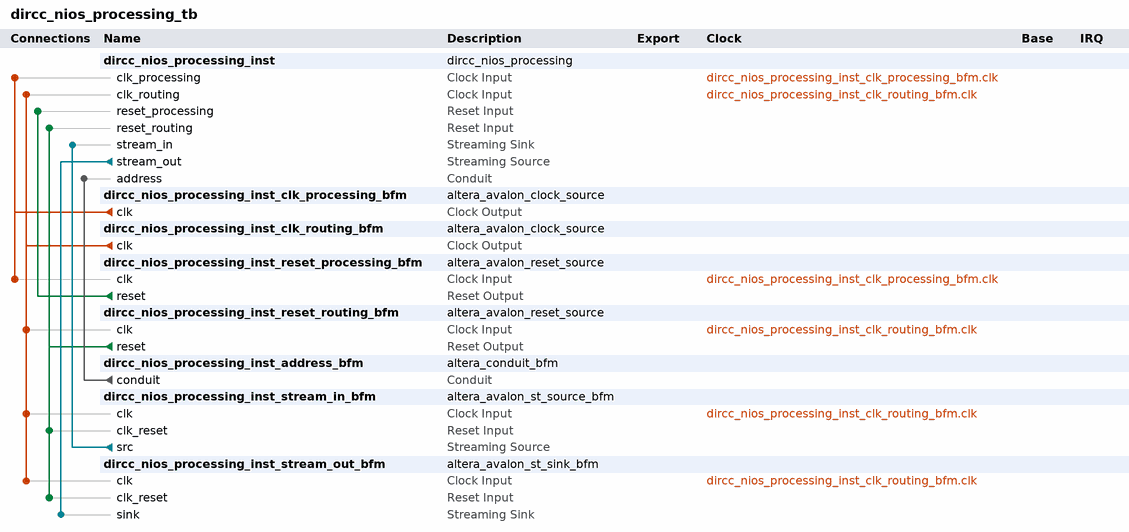
[diagram p0: system contents]
# Platform Designer (Qsys) system dircc_nios_processing_tb, Cyclone V 5CSEMA5F31C6
# Parameters at their usual value, and those the tool derives, are not listed.
package require -exact qsys 16.1
create_system dircc_nios_processing_tb
set_project_property DEVICE_FAMILY {Cyclone V}
set_project_property DEVICE 5CSEMA5F31C6

add_instance dircc_nios_processing_inst dircc_nios_processing 1.0

add_instance dircc_nios_processing_inst_clk_processing_bfm altera_avalon_clock_source 16.1

add_instance dircc_nios_processing_inst_clk_routing_bfm altera_avalon_clock_source 16.1

add_instance dircc_nios_processing_inst_reset_processing_bfm altera_avalon_reset_source 16.1
set_instance_parameter_value dircc_nios_processing_inst_reset_processing_bfm ASSERT_HIGH_RESET 0
set_instance_parameter_value dircc_nios_processing_inst_reset_processing_bfm INITIAL_RESET_CYCLES 50

add_instance dircc_nios_processing_inst_reset_routing_bfm altera_avalon_reset_source 16.1
set_instance_parameter_value dircc_nios_processing_inst_reset_routing_bfm ASSERT_HIGH_RESET 0
set_instance_parameter_value dircc_nios_processing_inst_reset_routing_bfm INITIAL_RESET_CYCLES 50

add_instance dircc_nios_processing_inst_address_bfm altera_conduit_bfm 16.1
set_instance_parameter_value dircc_nios_processing_inst_address_bfm CLOCKED_SIGNAL false
set_instance_parameter_value dircc_nios_processing_inst_address_bfm ENABLE_RESET false
set_instance_parameter_value dircc_nios_processing_inst_address_bfm SIGNAL_DIRECTIONS output
set_instance_parameter_value dircc_nios_processing_inst_address_bfm SIGNAL_ROLES address
set_instance_parameter_value dircc_nios_processing_inst_address_bfm SIGNAL_WIDTHS 32

add_instance dircc_nios_processing_inst_stream_in_bfm altera_avalon_st_source_bfm 16.1
set_instance_parameter_value dircc_nios_processing_inst_stream_in_bfm ST_CHANNEL_W 1
set_instance_parameter_value dircc_nios_processing_inst_stream_in_bfm ST_ERROR_W 1
set_instance_parameter_value dircc_nios_processing_inst_stream_in_bfm ST_MAX_CHANNELS 0
set_instance_parameter_value dircc_nios_processing_inst_stream_in_bfm ST_NUMSYMBOLS 4
set_instance_parameter_value dircc_nios_processing_inst_stream_in_bfm ST_READY_LATENCY 1
set_instance_parameter_value dircc_nios_processing_inst_stream_in_bfm ST_SYMBOL_W 8
set_instance_parameter_value dircc_nios_processing_inst_stream_in_bfm USE_CHANNEL 0
set_instance_parameter_value dircc_nios_processing_inst_stream_in_bfm USE_EMPTY 1
set_instance_parameter_value dircc_nios_processing_inst_stream_in_bfm USE_ERROR 0
set_instance_parameter_value dircc_nios_processing_inst_stream_in_bfm USE_PACKET 1
set_instance_parameter_value dircc_nios_processing_inst_stream_in_bfm USE_READY 1
set_instance_parameter_value dircc_nios_processing_inst_stream_in_bfm USE_VALID 1

add_instance dircc_nios_processing_inst_stream_out_bfm altera_avalon_st_sink_bfm 16.1
set_instance_parameter_value dircc_nios_processing_inst_stream_out_bfm ST_CHANNEL_W 1
set_instance_parameter_value dircc_nios_processing_inst_stream_out_bfm ST_ERROR_W 1
set_instance_parameter_value dircc_nios_processing_inst_stream_out_bfm ST_MAX_CHANNELS 0
set_instance_parameter_value dircc_nios_processing_inst_stream_out_bfm ST_NUMSYMBOLS 4
set_instance_parameter_value dircc_nios_processing_inst_stream_out_bfm ST_READY_LATENCY 1
set_instance_parameter_value dircc_nios_processing_inst_stream_out_bfm ST_SYMBOL_W 8
set_instance_parameter_value dircc_nios_processing_inst_stream_out_bfm USE_CHANNEL 0
set_instance_parameter_value dircc_nios_processing_inst_stream_out_bfm USE_EMPTY 1
set_instance_parameter_value dircc_nios_processing_inst_stream_out_bfm USE_ERROR 0
set_instance_parameter_value dircc_nios_processing_inst_stream_out_bfm USE_PACKET 1
set_instance_parameter_value dircc_nios_processing_inst_stream_out_bfm USE_READY 1
set_instance_parameter_value dircc_nios_processing_inst_stream_out_bfm USE_VALID 1
set_instance_parameter_value dircc_nios_processing_inst_stream_out_bfm VHDL_ID 0

# connections
add_connection dircc_nios_processing_inst_clk_processing_bfm.clk dircc_nios_processing_inst.clk_processing clock
add_connection dircc_nios_processing_inst_clk_processing_bfm.clk dircc_nios_processing_inst_reset_processing_bfm.clk clock
add_connection dircc_nios_processing_inst_clk_routing_bfm.clk dircc_nios_processing_inst.clk_routing clock
add_connection dircc_nios_processing_inst_clk_routing_bfm.clk dircc_nios_processing_inst_reset_routing_bfm.clk clock
add_connection dircc_nios_processing_inst_clk_routing_bfm.clk dircc_nios_processing_inst_stream_in_bfm.clk clock
add_connection dircc_nios_processing_inst_clk_routing_bfm.clk dircc_nios_processing_inst_stream_out_bfm.clk clock
add_connection dircc_nios_processing_inst_reset_processing_bfm.reset dircc_nios_processing_inst.reset_processing reset
add_connection dircc_nios_processing_inst_reset_routing_bfm.reset dircc_nios_processing_inst.reset_routing reset
add_connection dircc_nios_processing_inst_reset_routing_bfm.reset dircc_nios_processing_inst_stream_in_bfm.clk_reset reset
add_connection dircc_nios_processing_inst_reset_routing_bfm.reset dircc_nios_processing_inst_stream_out_bfm.clk_reset reset
add_connection dircc_nios_processing_inst.stream_out dircc_nios_processing_inst_stream_out_bfm.sink avalon_streaming
add_connection dircc_nios_processing_inst_stream_in_bfm.src dircc_nios_processing_inst.stream_in avalon_streaming
add_connection dircc_nios_processing_inst_address_bfm.conduit dircc_nios_processing_inst.address conduit

set_interconnect_requirement {$system} qsys_mm.clockCrossingAdapter HANDSHAKE
set_interconnect_requirement {$system} qsys_mm.enableEccProtection FALSE
set_interconnect_requirement {$system} qsys_mm.insertDefaultSlave FALSE
set_interconnect_requirement {$system} qsys_mm.maxAdditionalLatency 1

save_system dircc_nios_processing_tb.qsys
